# EAGLE design C64_KernalSw_16k (EAGLE 9.5.2)
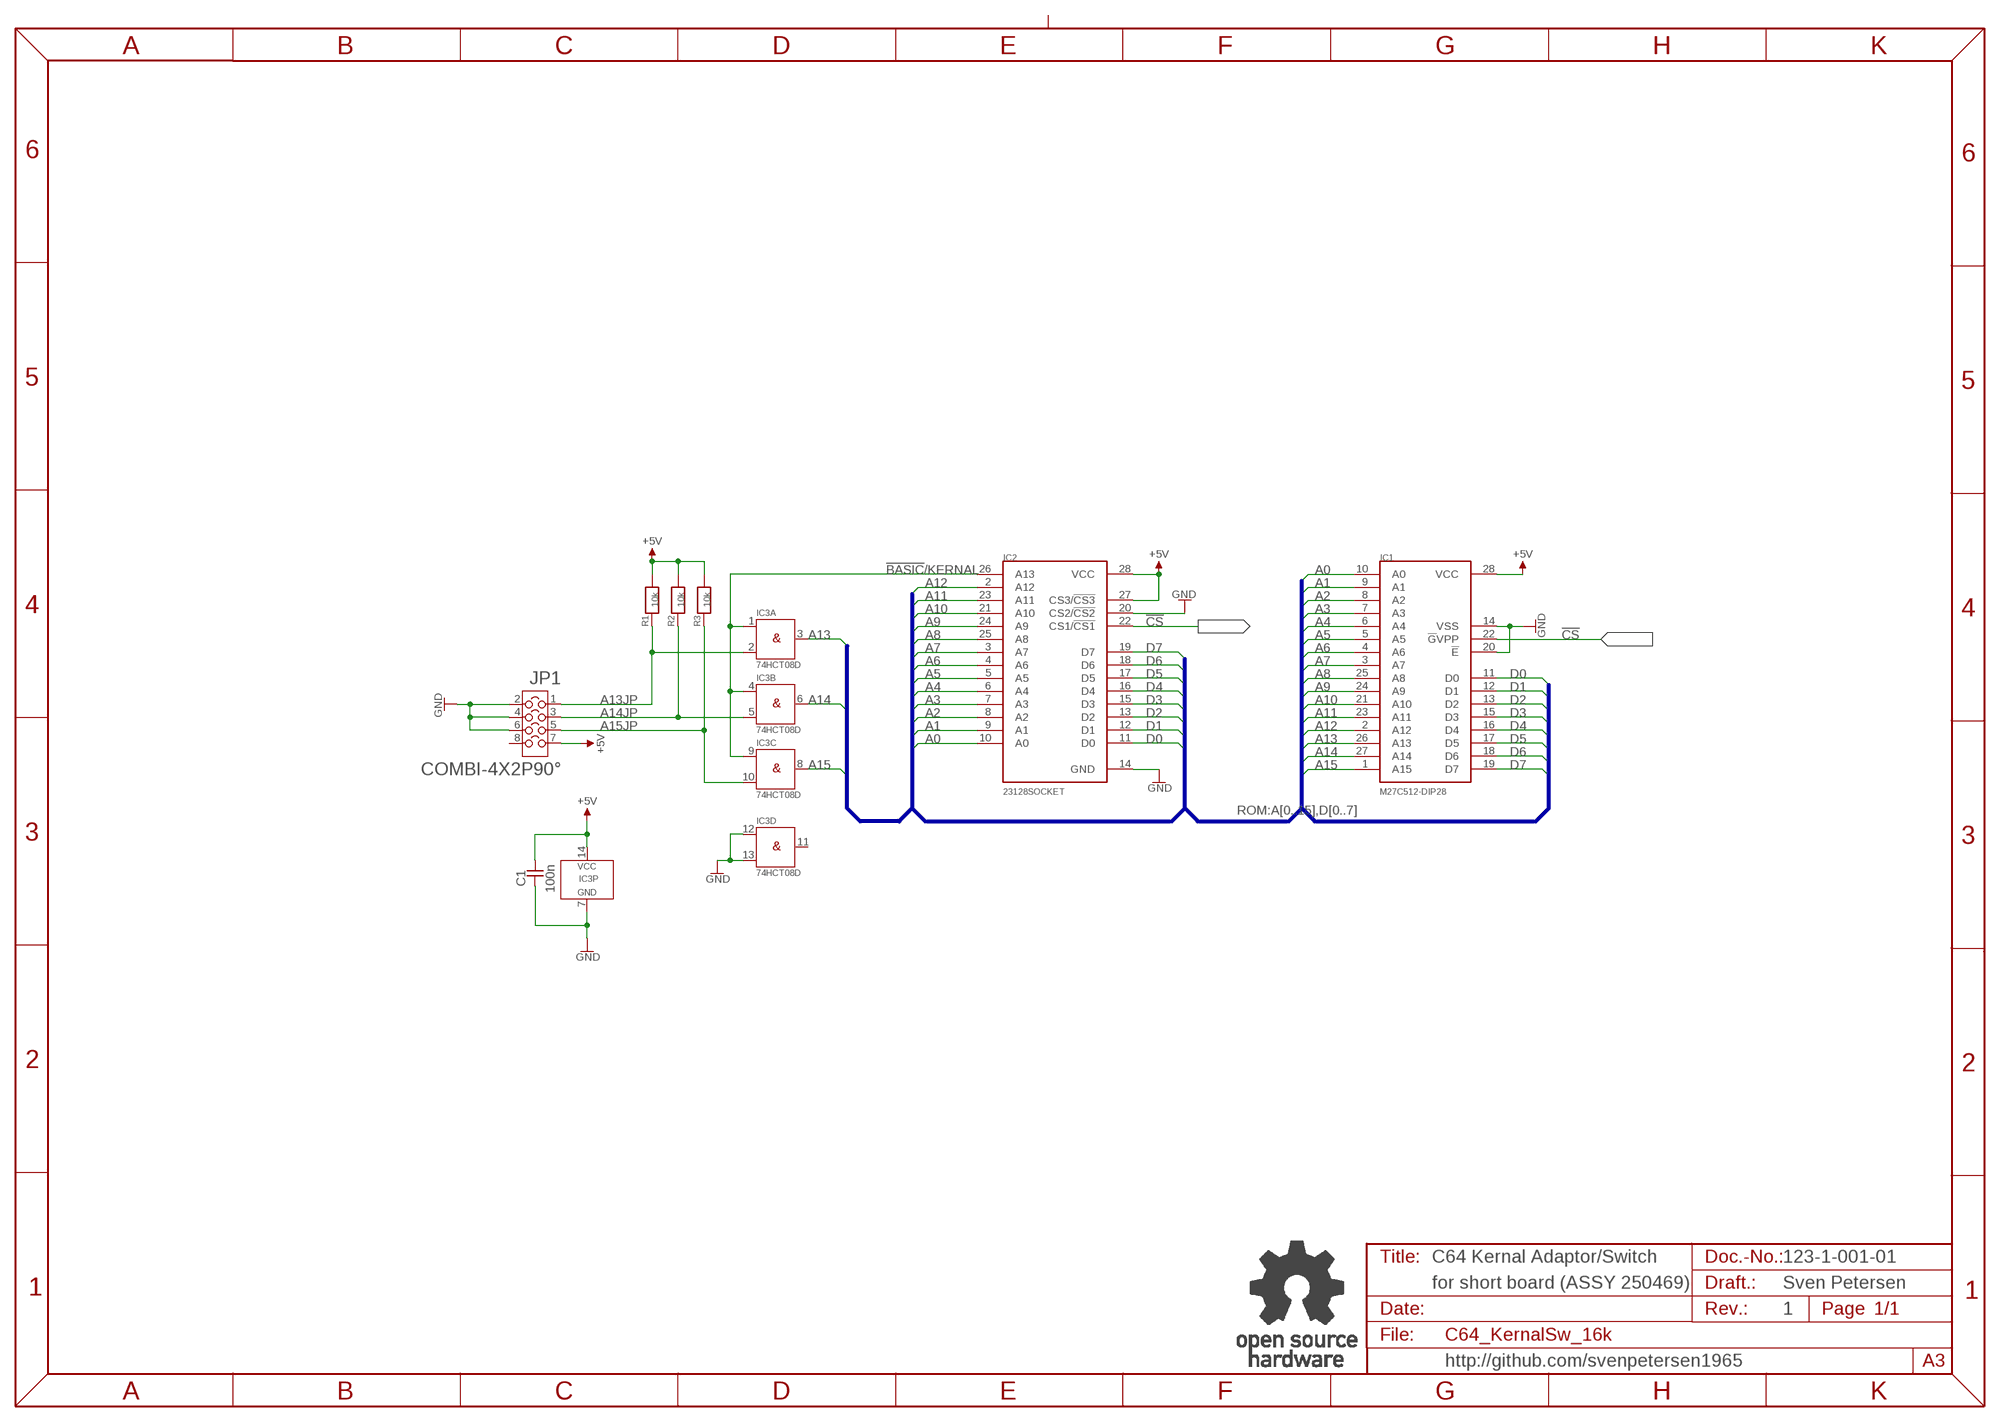
[diagram p0: schematic, sheet 1]

## Parts
C1  100n  C-0805  [0805]
IC1  M27C512-DIP28  [DIL28-6]
IC2  23128SOCKET  [DIL28_SOCKET]
IC3  74HCT08D  74HC08  [SO-14]
JP1  COMBI-4X2P90°  [COMBI-4X2-90]
R1  10k  R-0805  [0805]
R2  10k  R-0805  [0805]
R3  10k  R-0805  [0805]
U$21  OPEN_SOURCE_HW  [OPENHW]

## Nets
!BASIC!/KERNAL: IC2.26(A13) IC3.1(A:I0) IC3.4(B:I0) IC3.9(C:I0)
!CS: IC1.22(!G!VPP) IC2.22(CS1/!CS1)
+5V: C1.2 IC1.28(VCC) IC2.27(CS3/!CS3) IC2.28(VCC) IC3.14(P:VCC) JP1.7 R1.2 R2.2 R3.2
A0: IC1.10(A0) IC2.10(A0)
A1: IC1.9(A1) IC2.9(A1)
A2: IC1.8(A2) IC2.8(A2)
A3: IC1.7(A3) IC2.7(A3)
A4: IC1.6(A4) IC2.6(A4)
A5: IC1.5(A5) IC2.5(A5)
A6: IC1.4(A6) IC2.4(A6)
A7: IC1.3(A7) IC2.3(A7)
A8: IC1.25(A8) IC2.25(A8)
A9: IC1.24(A9) IC2.24(A9)
A10: IC1.21(A10) IC2.21(A10)
A11: IC1.23(A11) IC2.23(A11)
A12: IC1.2(A12) IC2.2(A12)
A13: IC1.26(A13) IC3.3(A:O)
A13JP: IC3.2(A:I1) JP1.1 R1.1
A14: IC1.27(A14) IC3.6(B:O)
A14JP: IC3.5(B:I1) JP1.3 R2.1
A15: IC1.1(A15) IC3.8(C:O)
A15JP: IC3.10(C:I1) JP1.5 R3.1
D0: IC1.11(D0) IC2.11(D0)
D1: IC1.12(D1) IC2.12(D1)
D2: IC1.13(D2) IC2.13(D2)
D3: IC1.15(D3) IC2.15(D3)
D4: IC1.16(D4) IC2.16(D4)
D5: IC1.17(D5) IC2.17(D5)
D6: IC1.18(D6) IC2.18(D6)
D7: IC1.19(D7) IC2.19(D7)
GND: C1.1 IC1.14(VSS) IC1.20(!E) IC2.14(GND) IC2.20(CS2/!CS2) IC3.7(P:GND) IC3.12(D:I0) IC3.13(D:I1) JP1.2 JP1.4 JP1.6
Unconnected: IC3.11(D:O) JP1.8

## Buses
ROM:A[0..15],D[0..7]

## Notes on the sheet
- C64 Kernal Adaptor/Switch | 123-1-001-01
- for short board (ASSY 250469) | Sven Petersen
- 1
- http://github.com/svenpetersen1965

## Library data of the parts
C1 = SMD:C-0805
IC1 = ST:M27C512
IC2 = MOS:23128
IC3 = 74XX:74*08: Quad 2-input AND gate SO14
JP1 = Cutpad:COMBI-4X2P
R1-R3 = SMD:R-0805
U$21 = Logo:OPEN_SOURCE_HW

## Board
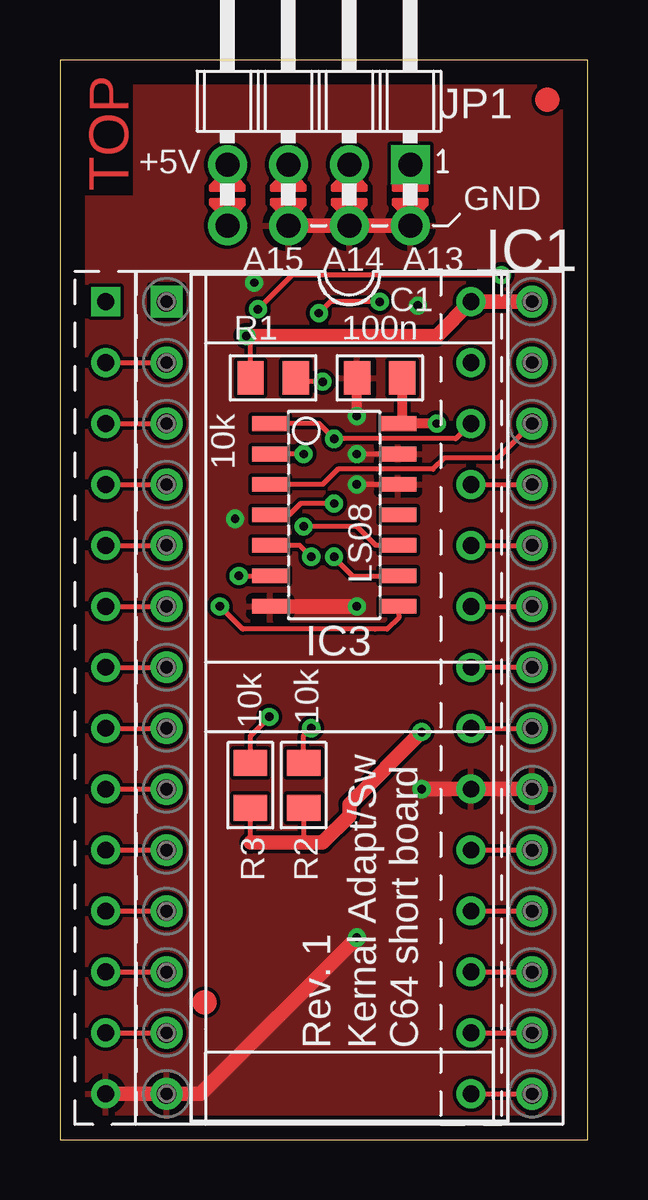
[diagram p1: board, top side]
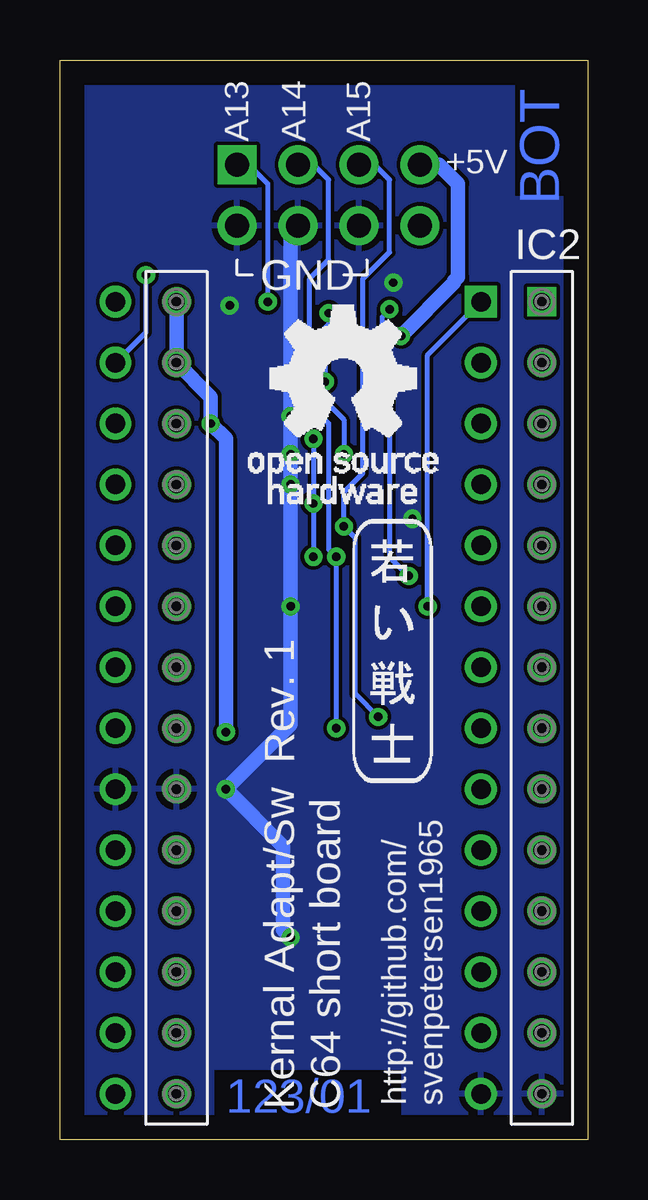
[diagram p2: board, bottom side, seen from below]

Size 22 x 45 mm. Coordinates in mm from the lower left corner, seen from the top.
Outline: 0,0 22,0 22,45 0,45 0,0
Copper layers (1*16): Top 0.035mm / dielectric 1.5mm / Bottom 0.035mm
Design rules "default *": minimum track width 6mil, minimum drill 0.35mm, track to track 6mil, track to pad 6mil, pad to pad 6mil, via to via 6mil, smd to smd 6mil, copper to edge 40mil, drill to drill 6mil, minimum pad ring 10mil, minimum via ring 8mil, stop-mask expansion 4mil, vias tented up to drill 24mil, thermal gap 10mil
bRestrict: 3 lines

### Footprints (pad centres in the part's own frame; a part is rotated, then mirrored left to right if it is on the bottom)
0805 = smd 1.092 x 1.397: 1 -0.94,0; 2 0.94,0
DIL28-6 = drill 0.813 square: 1 -16.51,-7.62 | drill 0.813: 2 -13.97,-7.62; 3 -11.43,-7.62; 4 -8.89,-7.62; 5 -6.35,-7.62; 6 -3.81,-7.62; 7 -1.27,-7.62; 8 1.27,-7.62; 9 3.81,-7.62; 10 6.35,-7.62; 11 8.89,-7.62; 12 11.43,-7.62; 13 13.97,-7.62; 14 16.51,-7.62; 15 16.51,7.62; 16 13.97,7.62; 17 11.43,7.62; 18 8.89,7.62; 19 6.35,7.62; 20 3.81,7.62; 21 1.27,7.62; 22 -1.27,7.62; 23 -3.81,7.62; 24 -6.35,7.62; 25 -8.89,7.62; 26 -11.43,7.62; 27 -13.97,7.62; 28 -16.51,7.62
DIL28_SOCKET = drill 0.7 square: 1 -16.51,-7.62 | drill 0.7: 2 -13.97,-7.62; 3 -11.43,-7.62; 4 -8.89,-7.62; 5 -6.35,-7.62; 6 -3.81,-7.62; 7 -1.27,-7.62; 8 1.27,-7.62; 9 3.81,-7.62; 10 6.35,-7.62; 11 8.89,-7.62; 12 11.43,-7.62; 13 13.97,-7.62; 14 16.51,-7.62; 15 16.51,7.62; 16 13.97,7.62; 17 11.43,7.62; 18 8.89,7.62; 19 6.35,7.62; 20 3.81,7.62; 21 1.27,7.62; 22 -1.27,7.62; 23 -3.81,7.62; 24 -6.35,7.62; 25 -8.89,7.62; 26 -11.43,7.62; 27 -13.97,7.62; 28 -16.51,7.62
SO-14 = smd 0.61 x 1.524: 1 -3.81,-2.667; 2 -2.54,-2.667; 3 -1.27,-2.667; 4 0,-2.667; 5 1.27,-2.667; 6 2.54,-2.667; 7 3.81,-2.667; 8 3.81,2.667; 9 2.54,2.667; 10 1.27,2.667; 11 0,2.667; 12 -1.27,2.667; 13 -2.54,2.667; 14 -3.81,2.667
COMBI-4X2-90 = drill 1 pad 1.626 square: 1 -1.27,3.81 | drill 1 pad 1.626: 2 1.27,3.81; 3 -1.27,1.27; 4 1.27,1.27; 5 -1.27,-1.27; 6 1.27,-1.27; 7 -1.27,-3.81; 8 1.27,-3.81

### Placement (x,y rotation side)
C1  13.34,31.75 0 top
IC1  12.06,18.41 270 top
IC2  9.53,18.41 270 top
IC3  11.43,26.04 270 top
JP1  10.79,39.37 270 top
R1  8.89,31.75 180 top
R2  10.16,14.76 270 top
R3  7.94,14.76 270 top
U$16  [GS28P]  12.06,18.41 270 top
U$17  [SMD_REF_R1MM]  20.32,43.34 0 top
U$18  [SMD_REF_R1MM]  6.03,5.71 0 top
U$19  [2LAYER]  2.86,39.53 90 top
U$20  [PCB-TITLE/]  0,58.58 0 top  (outside the outline)
U$21  14.13,26.51 0 bottom
U$22  [SVEN_TAG]  8.1,20.48 0 bottom

### Tracks (layer width: path | path; a pad name or v marks a point on that pad's centre or on a via)
!BASIC!/KERNAL  (via drill 0.35)
  Top 0.203: IC2.26 16.51,29.21 v11.43,29.21 10.79,29.84 IC3.1 | v11.43,26.51 10.03,26.51 9.56,26.04 IC3.4 | v11.43,24.29 11.43,24.26 12.19,23.5 IC3.9
  Bottom 0.203: v11.43,29.21 v11.43,26.51 v11.43,24.29
!CS
  Top 0.203: IC1.22 IC2.22
+5V  (via drill 0.35)
  Top 0.203: R1.2 7.95,33.33 v7.78,33.5 | 7.94,12.38 R3.2 | R2.2 10.16,12.38
  Top 0.406: C1.2 14.28,30.02 IC3.14 v15.72,29.84
  Top 0.61: IC1.28 IC2.28 15.72,33.5 14.29,33.5 v7.78,33.5 | v15.08,16.99 12.06,13.97 12.06,13.49 10.95,12.38 10.48,12.38 10.16,12.38 7.94,12.38
  Bottom 0.61: IC2.28 IC2.27 15.72,30.96 v15.72,29.84 15.08,29.21 v15.08,16.99 | JP1.7 6.19,40.64 5.4,39.85 5.4,35.94 5.56,35.77 5.56,35.71 v7.78,33.5
A0
  Top 0.203: IC2.10 IC1.10
A1
  Top 0.203: IC2.9 IC1.9
A2
  Top 0.203: IC2.8 IC1.8
A3
  Top 0.203: IC2.7 IC1.7
A4
  Top 0.203: IC2.6 IC1.6
A5
  Top 0.203: IC2.5 IC1.5
A6
  Top 0.203: IC2.4 IC1.4
A7
  Top 0.203: IC2.3 IC1.3
A8
  Top 0.203: IC2.25 IC1.25
A9
  Top 0.203: IC2.24 IC1.24
A10
  Top 0.203: IC2.21 IC1.21
A11
  Top 0.203: IC2.23 IC1.23
A12
  Top 0.203: IC2.2 IC1.2
A13
  Top 0.203: IC1.26 18.26,28.42 16.03,28.42 15.56,27.94 11.59,27.94 10.95,27.3 IC3.3
A13JP  (via drill 0.35)
  Top 0.203: v13.34,34.92 11.27,34.92 v10.79,34.45 | v10.95,31.59 9.99,31.59 R1.1 | v10.16,28.57 IC3.2
  Bottom 0.203: JP1.1 14.13,40.64 13.34,39.85 13.34,36.67 v13.34,34.92 | v10.79,34.45 10.79,33.97 10.95,33.81 v10.95,31.59 10.95,30.8 10.16,30 v10.16,28.57
A14  (via drill 0.35)
  Top 0.203: v18.41,36.04 9.68,36.04 v8.26,34.61 | v7.46,23.5 IC3.6
  Bottom 0.203: IC1.27 18.41,33.66 v18.41,36.04 | v8.26,34.61 8.57,34.29 8.57,32.7 8.26,32.38 8.26,24.29 v7.46,23.5
A14JP  (via drill 0.35)
  Top 0.203: R2.1 10.16,16.83 v10.48,17.14 | v10.48,24.29 10,24.77 IC3.5
  Bottom 0.203: v10.48,17.14 v10.48,24.29 10.79,24.61 10.79,29.84 11.59,30.64 11.59,35.88 10.79,36.67 10.79,40.01 11.43,40.64 JP1.3
A15  (via drill 0.35)
  Top 0.203: IC3.8 14.13,21.75 13.65,21.27 13.14,21.27 7.62,21.27 v6.67,22.23
  Bottom 0.203: v6.67,22.23 6.67,32.7 IC1.1
A15JP  (via drill 0.35)
  Top 0.203: v10.16,25.56 12.38,25.56 13.18,24.77 IC3.10 | R3.1 7.94,16.83 v8.73,17.62
  Bottom 0.203: JP1.5 8.89,40.64 8.26,40.01 8.26,36.99 9.37,35.88 9.37,27.78 10.16,26.99 v10.16,25.56 9.68,25.08 9.68,18.57 v8.73,17.62
D0
  Top 0.203: IC2.11 IC1.11
D1
  Top 0.203: IC2.12 IC1.12
D2
  Top 0.203: IC2.13 IC1.13
D3
  Top 0.203: IC2.15 IC1.15
D4
  Top 0.203: IC2.16 IC1.16
D5
  Top 0.203: IC2.17 IC1.17
D6
  Top 0.203: IC2.18 IC1.18
D7
  Top 0.203: IC2.19 IC1.19
GND  (via drill 0.35)
  Top 0.203: IC3.13 v12.38,28.57 | IC3.12 v12.38,27.3
  Top 0.406: v12.38,30.16 12.38,31.74
  Top 0.61: JP1.6 JP1.4 JP1.2 | 12.38,31.74 C1.1 | v12.38,8.41 5.87,1.91 IC1.14 IC2.14 | v15.08,14.61 IC2.20 IC1.20 | v12.38,22.23 IC3.7
  Bottom 0.61: JP1.4 12.38,37.78 v12.38,30.16 v12.38,28.57 v12.38,27.3 v12.38,22.23 12.38,20.64 12.38,17.3 v15.08,14.61 12.7,12.22 12.7,8.73 v12.38,8.41
  other vias: 8.1,35.72 14.92,34.77 7.3,25.88
  pour Top: 0.64,0.64 21.27,0.64 21.27,44.13 0.64,44.13
  pour Bottom: 0.64,0.64 21.27,0.64 21.27,44.13 0.64,44.13

### Text on the board
Bottom: 123/01
tPlace: +5V | GND | A15 | A14 | A13 | 100n | 10k | LS08 | 10k | 10k | Rev. 1 | Kernal Adapt/Sw / C64 short board
bPlace: A15 | A14 | A13 | +5V | GND | http://github.com/ / svenpetersen1965 | Kernal Adapt/Sw Rev. 1 / C64 short board
Document: Sven Petersen | 123-2-01-01 | 2021 | 35µm | 2 | 1